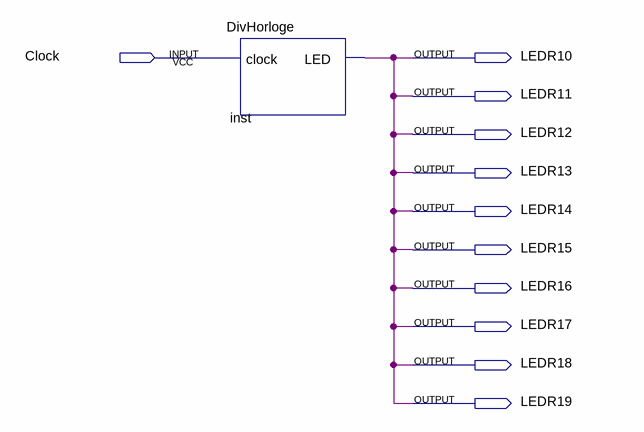
[diagram p0: schematic sheet]
// Quartus schematic test.bdf as structural Verilog: 1 symbols, 11 pins
module test (
  input  Clock,
  output LEDR10,
  output LEDR11,
  output LEDR12,
  output LEDR13,
  output LEDR14,
  output LEDR15,
  output LEDR16,
  output LEDR17,
  output LEDR18,
  output LEDR19
);

  DivHorloge inst (.clock(Clock), .LED(LEDR10));

  assign LEDR11 = LEDR10;
  assign LEDR12 = LEDR10;
  assign LEDR13 = LEDR10;
  assign LEDR14 = LEDR10;
  assign LEDR15 = LEDR10;
  assign LEDR16 = LEDR10;
  assign LEDR17 = LEDR10;
  assign LEDR18 = LEDR10;
  assign LEDR19 = LEDR10;
endmodule
